# Altium schematic sheet LED.SchDoc: LED Status
size A4; Author: Miłosz Werner & Julia Rzepka; DrawnBy: Miłosz Werner; Organization: Wroclaw University of Science and Technology; Revision: 1.0; SheetNumber: 6; SheetTotal: 8
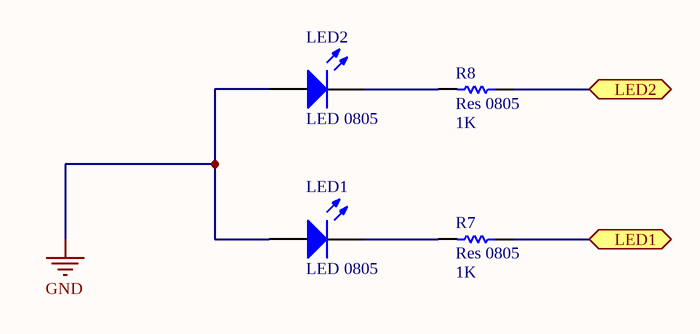
[diagram p0: LED.SchDoc]

## Parts
LED1  LED 0805  [0805_A]
LED2  LED 0805  [0805_A]
R7  Res 0805  value 1K  [RESC2013X50X30LL20T20]
R8  Res 0805  value 1K  [RESC2013X50X30LL20T20]

## Ports
LED1 (bidir), LED2 (bidir)

## Nets
GND: LED1.2(A) LED2.2(A)
LED1: R7.1 ; port LED1
LED2: R8.1 ; port LED2
NetLED1_1: LED1.1(K) R7.2
NetLED2_1: LED2.1(K) R8.2

## Library data of the parts
LED1 LED2 = CMP-1426-00010-1: LED; Manufacturer: Wuerth Elektronik; PartNumber: 150080SS75000; Color: Super Red; PackageReference: 0805_A; ComponentLink2URL: http://katalog.we-online.com/led/datasheet/150080SS75000.pdf; ComponentLink1URL: http://www.we-online.com; ComponentLink2Description: Datasheet; ComponentLink1Description: Manufacturer URL
R7 R8 = CMP-2001-03735-1: Resistor